# EAGLE design Controller-Modul (EAGLE 7.5.0)
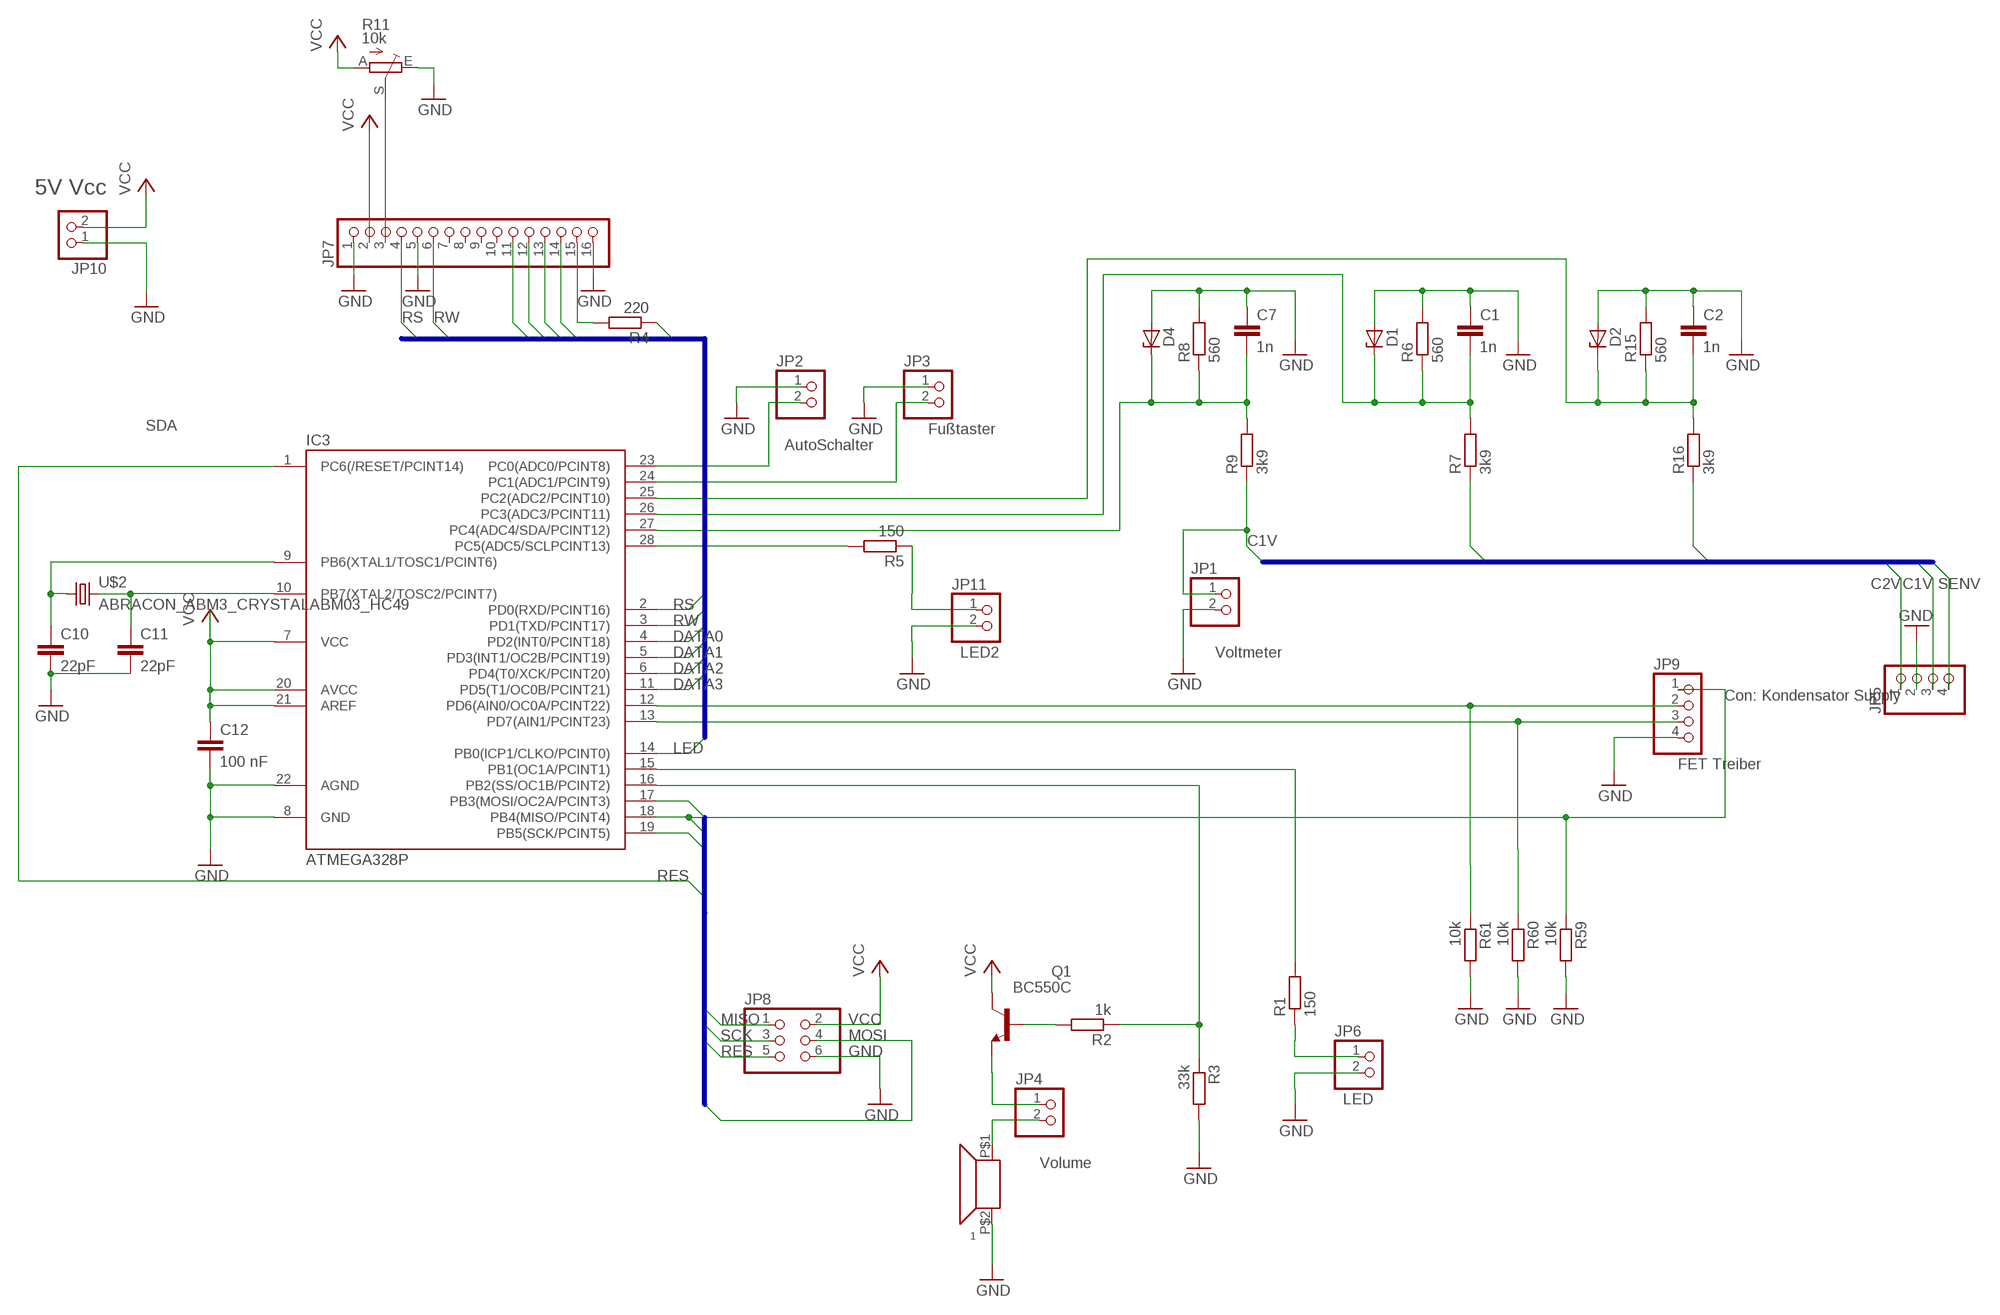
[diagram p0: schematic, sheet 1]

## Parts
1  SUMMER4  [PIEZO-INDIKATOR-KPMG]
C1  1n  C-EUC0603K  [C0603K]
C2  1n  C-EUC0603K  [C0603K]
C7  1n  C-EUC0603K  [C0603K]
C10  22pF  C-EUC0603K  [C0603K]
C11  22pF  C-EUC0603K  [C0603K]
C12  100 nF  C-EUC0603  [C0603]
D1  ZENER-DIODESOT23  [SOT23]
D2  ZENER-DIODESOT23  [SOT23]
D4  ZENER-DIODESOT23  [SOT23]
IC3  ATMEGA328P  MEGA48/88/168-PU  [DIL28-3]
JP1  PINHD-1X2  [1X02]
JP2  PINHD-1X2  [1X02]
JP3  PINHD-1X2  [1X02]
JP4  PINHD-1X2  [1X02]
JP5  PINHD-1X4  [1X04]
JP6  PINHD-1X2  [1X02]
JP7  PINHD-1X16  [1X16]
JP8  PINHD-2X3  [2X03]
JP9  PINHD-1X4  [1X04]
JP10  PINHD-1X2  [1X02]
JP11  PINHD-1X2  [1X02]
Q1  BC550C  [TO92-EBC]
R1  150  R-EU_R1206  [R1206]
R2  1k  R-EU_R1206  [R1206]
R3  33k  R-EU_R1206  [R1206]
R4  220  R-EU_R1206  [R1206]
R5  150  R-EU_R1206  [R1206]
R6  560  R-EU_R1206  [R1206]
R7  3k9  R-EU_R1206  [R1206]
R8  560  R-EU_R1206  [R1206]
R9  3k9  R-EU_R1206  [R1206]
R11  10k  TRIM_EU-PT10  [PT-10]
R15  560  R-EU_R1206  [R1206]
R16  3k9  R-EU_R1206  [R1206]
R59  10k  R-EU_R1206  [R1206]
R60  10k  R-EU_R1206  [R1206]
R61  10k  R-EU_R1206  [R1206]
U$2  ABRACON_ABM3_CRYSTALABM03_HC49  [ABM03_HC49]

## Nets
C1V: JP1.1 JP5.3 R9.1
C2V: JP5.1 R7.1
DATA0: IC3.4(PD2(INT0/PCINT18)) JP7.11
DATA1: IC3.5(PD3(INT1/OC2B/PCINT19)) JP7.12
DATA2: IC3.6(PD4(T0/XCK/PCINT20)) JP7.13
DATA3: IC3.11(PD5(T1/OC0B/PCINT21)) JP7.14
FET2: IC3.13(PD7(AIN1/PCINT23)) JP9.3 R60.1
FET3: IC3.12(PD6(AIN0/OC0A/PCINT22)) JP9.2 R61.1
GND: 1.P$2(+) C1.1 C2.1 C7.1 C10.2 C11.2 C12.2 D1.1(A) D2.1(A) D4.1(A) IC3.8(GND) IC3.22(AGND) JP1.2 JP2.1 JP3.1 JP5.2 JP6.2 JP7.1 JP7.5 JP7.16 JP8.6 JP9.4 JP10.1 JP11.2 R3.2 R6.2 R8.2 R11.E R15.2 R59.2 R60.2 R61.2
LED: IC3.14(PB0(ICP1/CLKO/PCINT0)) R4.1
MISO: IC3.18(PB4(MISO/PCINT4)) JP8.1 JP9.1 R59.1
MOSI: IC3.17(PB3(MOSI/OC2A/PCINT3)) JP8.4
N$1: JP11.1 R5.1
N$2: IC3.28(PC5(ADC5/SCLPCINT13)) R5.2
N$4: Q1.B R2.2
N$5: C7.2 D4.3(C) IC3.27(PC4(ADC4/SDA/PCINT12)) R8.1 R9.2
N$6: JP6.1 R1.1
N$7: C1.2 D1.3(C) IC3.26(PC3(ADC3/PCINT11)) R6.1 R7.2
N$9: IC3.16(PB2(SS/OC1B/PCINT2)) R2.1 R3.1
N$10: IC3.23(PC0(ADC0/PCINT8)) JP2.2
N$11: JP4.1 Q1.E
N$12: IC3.24(PC1(ADC1/PCINT9)) JP3.2
N$13: 1.P$1(-) JP4.2
N$18: C2.2 D2.3(C) IC3.25(PC2(ADC2/PCINT10)) R15.1 R16.2
N$26: IC3.15(PB1(OC1A/PCINT1)) R1.2
N$27: C11.1 IC3.10(PB7(XTAL2/TOSC2/PCINT7)) U$2.2
N$28: C10.1 IC3.9(PB6(XTAL1/TOSC1/PCINT6)) U$2.1
N$32: JP7.3 R11.S
N$47: JP7.15 R4.2
RES: IC3.1(PC6(/RESET/PCINT14)) JP8.5
RS: IC3.2(PD0(RXD/PCINT16)) JP7.4
RW: IC3.3(PD1(TXD/PCINT17)) JP7.6
SCK: IC3.19(PB5(SCK/PCINT5)) JP8.3
SENV: JP5.4 R16.1
VCC: C12.1 IC3.7(VCC) IC3.20(AVCC) IC3.21(AREF) JP7.2 JP8.2 JP10.2 Q1.C R11.A
Unconnected: JP7.7 JP7.8 JP7.9 JP7.10

## Buses
DISPLAY:DATA[0..3],RS,RW,LED
ISP:MISO,MOSI,SCK,RES
VOLTAGEMEASURES:C1V,C2V,SENV

## Notes on the sheet
- 5V Vcc
- SDA | Fußtaster
- AutoSchalter
- LED2 | Voltmeter
- Con: Kondensator Supply
- FET Treiber
- LED
- Volume

## Library data of the parts
1 = 0liver:SUMMER: SUMMER BS 27HS :: Piezosummer https://www.reichelt.de/Signalakustik/SUMMER-BS-27HS/3/index.html?&ACTION=3&LA=446&GROUPID=6560&ARTICLE=35922
C1 C2 C7 = rcl:C-EU: CAPACITOR, European symbol
C10-C12 = resistor:C-EU: CAPACITOR, European symbol
D1 D2 D4 = diode:ZENER-DIODE: Z-Diode
IC3 = avr-6:MEGA48/88/168-PU
JP1-JP4 JP6 JP10 JP11 = pinhead:PINHD-1X2: PIN HEADER
JP5 JP9 = pinhead:PINHD-1X4: PIN HEADER
JP7 = pinhead:PINHD-1X16: PIN HEADER
JP8 = pinhead:PINHD-2X3: PIN HEADER
Q1 = transistor-npn:BC550*: NPN Transistor
R1 R5 = rcl:R-EU_: RESISTOR, European symbol
R2-R4 R6-R9 R15 R16 R59-R61 = resistor:R-EU_: RESISTOR, European symbol
R11 = pot:TRIM_EU-: POTENTIOMETER
U$2 = Ava:ABRACON_ABM3_CRYSTAL

## Board
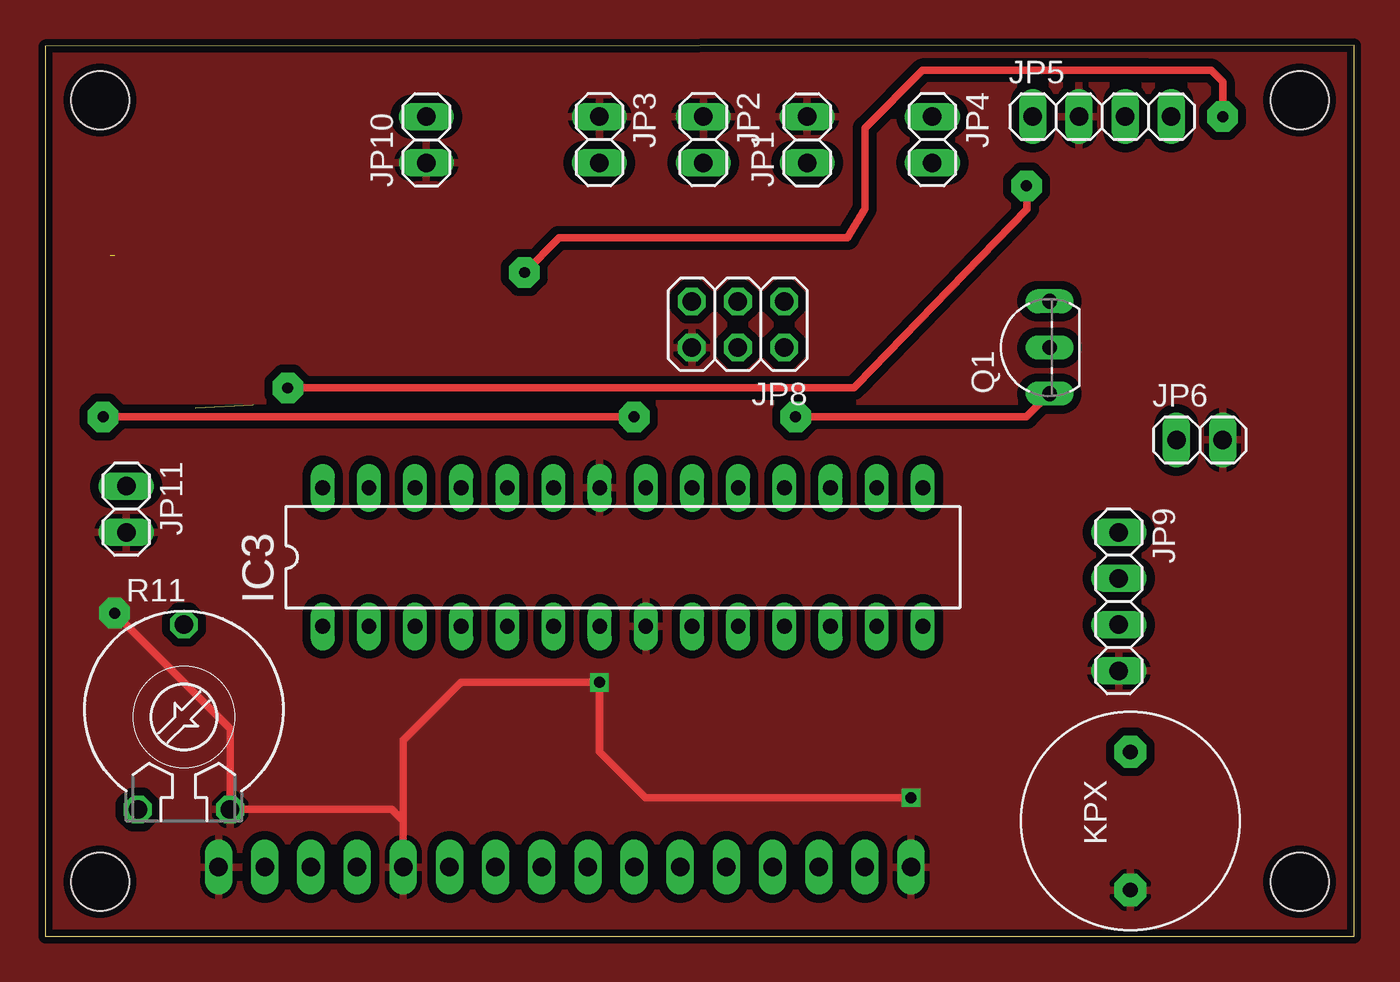
[diagram p1: board, top side]
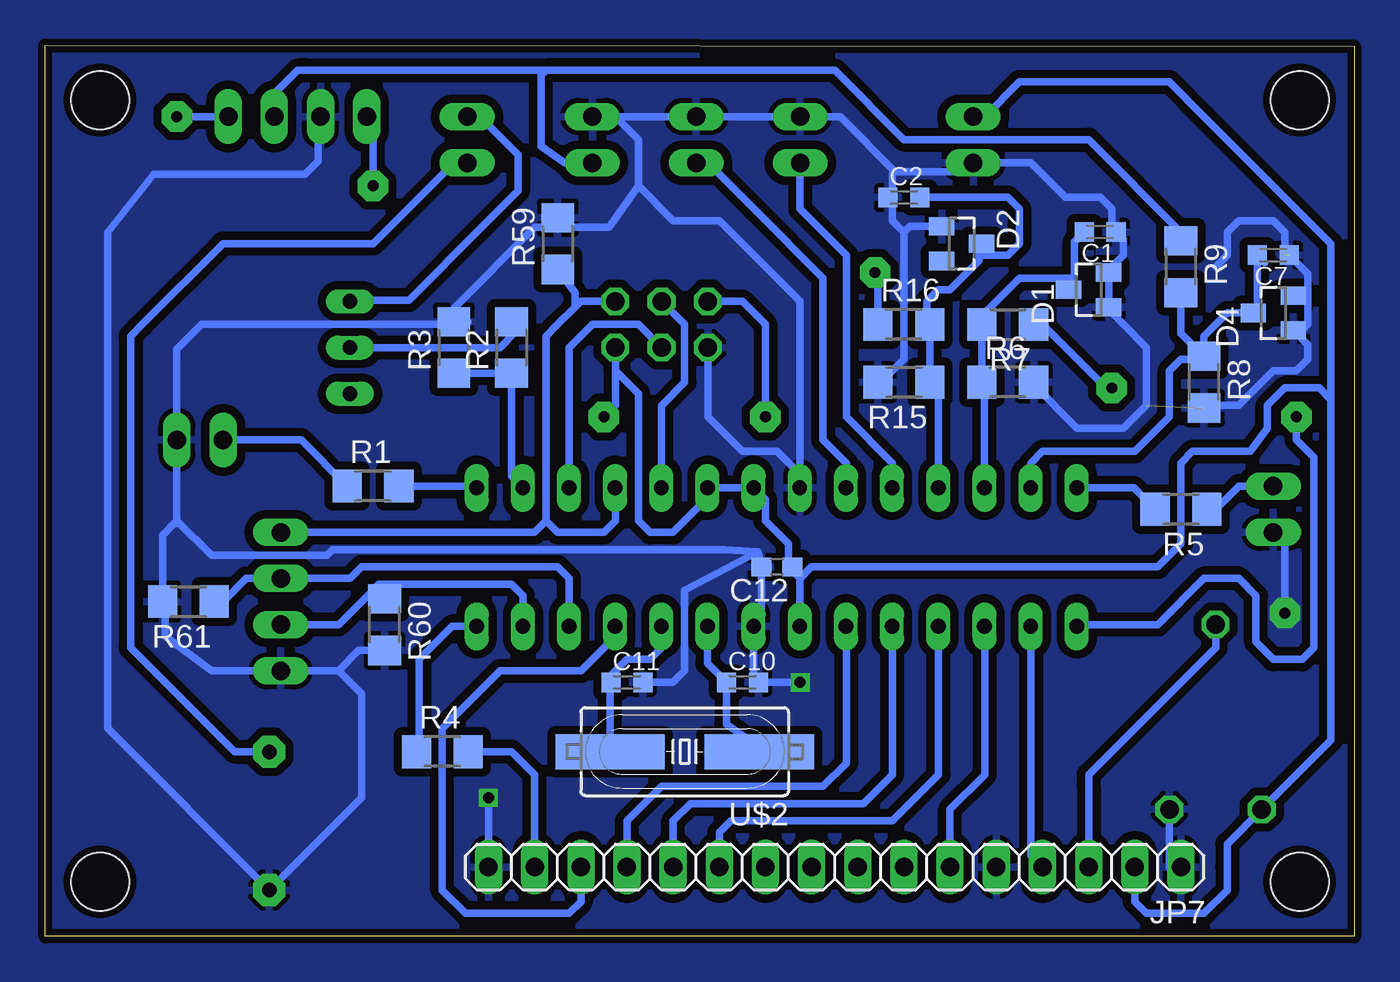
[diagram p2: board, bottom side, seen from below]

Size 72 x 49 mm. Coordinates in mm from the lower left corner, seen from the top.
Outline: 0,0 72,0 72,49 0,48.95 0,0
Copper layers (1*16): Top 0.035mm / dielectric 1.5mm / Bottom 0.035mm
Design rules "default *": minimum track width 10mil, minimum drill 24mil, track to track 18mil, track to pad 18mil, pad to pad 18mil, via to via 18mil, smd to smd 8mil, copper to edge 15mil, drill to drill 8mil, minimum pad ring 10mil, minimum via ring 8mil, stop-mask expansion 4mil, vias tented up to drill 0mil, thermal gap 10mil
Holes 3.2 mm at 3,3 69,3 3,46 69,46

### Footprints (pad centres in the part's own frame; a part is rotated, then mirrored left to right if it is on the bottom)
PIEZO-INDIKATOR-KPMG = drill 0.8 pad 1.778 octagon: P$1 3.8,0; P$2 -3.8,0
C0603K = smd 1.05 x 1.08: 1 -0.875,0; 2 0.875,0
C0603 = smd 1.1 x 1: 1 -0.85,0; 2 0.85,0
SOT23 = smd 1 x 1.4: 1 -0.95,-1.1; 2 0.95,-1.1; 3 0,1.1
DIL28-3 = drill 0.813 long: 1 -16.51,-3.81; 2 -13.97,-3.81; 3 -11.43,-3.81; 4 -8.89,-3.81; 5 -6.35,-3.81; 6 -3.81,-3.81; 7 -1.27,-3.81; 8 1.27,-3.81; 9 3.81,-3.81; 10 6.35,-3.81; 11 8.89,-3.81; 12 11.43,-3.81; 13 13.97,-3.81; 14 16.51,-3.81; 15 16.51,3.81; 16 13.97,3.81; 17 11.43,3.81; 18 8.89,3.81; 19 6.35,3.81; 20 3.81,3.81; 21 1.27,3.81; 22 -1.27,3.81; 23 -3.81,3.81; 24 -6.35,3.81; 25 -8.89,3.81; 26 -11.43,3.81; 27 -13.97,3.81; 28 -16.51,3.81
1X02 = drill 1.016 long: 1 -1.27,0; 2 1.27,0
1X04 = drill 1.016 long: 1 -3.81,0; 2 -1.27,0; 3 1.27,0; 4 3.81,0
1X16 = drill 1.016 long: 1 -19.05,0; 2 -16.51,0; 3 -13.97,0; 4 -11.43,0; 5 -8.89,0; 6 -6.35,0; 7 -3.81,0; 8 -1.27,0; 9 1.27,0; 10 3.81,0; 11 6.35,0; 12 8.89,0; 13 11.43,0; 14 13.97,0; 15 16.51,0; 16 19.05,0
2X03 = drill 1.016 octagon: 1 -2.54,-1.27; 2 -2.54,1.27; 3 0,-1.27; 4 0,1.27; 5 2.54,-1.27; 6 2.54,1.27
TO92-EBC = drill 0.813 long: B 0,-1.27; C -2.54,-1.27; E 2.54,-1.27
R1206 = smd 1.6 x 1.803: 1 -1.422,0; 2 1.422,0
PT-10 = drill 1.016 octagon: A -2.54,-5.08; E 2.54,-5.08; S 0,5.08
ABM03_HC49 = smd 6 x 1.93: 1 -4.1,0; 2 4.1,0

### Placement (x,y rotation side)
1  59.69,6.35 90 top
C1  13.97,38.73 180 bottom
C2  24.77,40.64 0 bottom
C7  4.45,37.47 180 bottom
C10  33.66,13.97 0 bottom
C11  40.01,13.97 0 bottom
C12  31.75,20.32 180 bottom
D1  14.61,35.56 90 bottom
D2  21.59,38.1 270 bottom
D4  4.45,34.29 90 bottom
IC3  31.77,20.86 0 top
JP1  41.91,43.81 90 top
JP2  36.2,43.81 270 top
JP3  30.48,43.81 270 top
JP4  48.8,43.81 270 top
JP5  58.13,45.09 0 top
JP6  63.5,27.3 0 top
JP7  28.57,3.81 180 bottom
JP8  38.1,33.66 180 top
JP9  59.05,18.41 270 top
JP10  20.95,43.81 90 top
JP11  4.45,23.5 270 top
Q1  53.98,32.38 90 top
R1  53.98,24.77 0 bottom
R2  46.35,32.38 90 bottom
R3  49.53,32.38 90 bottom
R4  50.16,10.16 0 bottom
R5  9.53,23.5 180 bottom
R6  19.05,30.48 0 bottom
R7  19.05,33.66 180 bottom
R8  8.26,30.48 270 bottom
R9  9.53,36.83 270 bottom
R11  7.62,12.06 0 top
R15  24.77,30.48 180 bottom
R16  24.77,33.66 0 bottom
R59  43.81,38.1 90 bottom
R60  53.34,17.14 270 bottom
R61  64.14,18.41 180 bottom
U$2  36.83,10.16 180 bottom

### Tracks (layer width: path | path; a pad name or v marks a point on that pad's centre or on a via)
C1V
  Bottom 0.406: JP1.1 43.45,42.55 44.72,43.45 44.72,47.35 44.45,47.62 | 44.45,47.62 28.57,47.62 24.77,43.81 14.61,43.81 9.53,38.73 R9.1 | 57.5,47.62 58.13,47.62 | 58.13,47.62 57.5,47.62 | 57.5,47.62 44.45,47.62 | 57.5,47.62 58.13,47.62 | 58.13,47.62 59.41,46.35 JP5.3
C2V  (via drill 0.6 pad 1.68)
  Top 0.406: 44.48,30.16 44.62,30.31 | 44.62,30.31 54,40 54,40.95 54,41.25 v53.98,41.27 | v13.34,30.16 44.48,30.16 44.62,30.31
  Bottom 0.406: R7.1 17.14,33.66 14.61,31.11 13.97,30.48 13.65,30.48 v13.34,30.16 | v53.98,41.27 53.98,44.73 JP5.1
DATA0
  Bottom 0.406: JP7.11 34.92,5.71 34.29,6.35 25.4,6.35 22.86,8.89 22.86,17.04 IC3.4
DATA1
  Bottom 0.406: JP7.12 37.47,6.35 36.51,7.3 26.99,7.3 25.4,8.89 25.4,17.04 IC3.5
DATA2
  Bottom 0.406: JP7.13 40.01,6.35 38.1,8.26 29.21,8.26 27.94,9.53 27.94,17.04 IC3.6
DATA3
  Bottom 0.406: JP7.14 42.55,1.91 43.18,1.27 48.9,1.27 50.16,2.54 50.16,11.43 46.99,14.61 42.55,14.61 40.64,16.51 40.64,17.04 IC3.11
FET2
  Bottom 0.406: IC3.13 45.73,18.75 46.35,19.37 53.66,19.37 53.98,19.05 | 53.98,19.05 55.88,17.14 JP9.3 | R60.1 53.98,18.57 53.98,19.05
FET3
  Bottom 0.406: IC3.12 43.2,19.7 43.5,20 | 43.5,20 43.81,20.32 | 43.81,20.32 54.61,20.32 55.24,19.68 JP9.2 60.96,19.68 62.23,18.41 R61.1 | 43.81,20.32 43.5,20
GND  (via drill 0.6, 0.6 pad 1.02, 0.6 pad 1.68)  (2 unrouted)
  Top 0.406: 19.68,6.35 19.68,10.79 22.86,13.97 v30.48,13.97 30.48,10.16 33.02,7.62 45.72,7.62 v47.62,7.62 | 19.68,6.35 JP7.5 19.68,6.35 | 19.68,6.35 19.05,6.99 R11.E 10.16,11.43 v3.81,17.78
  Bottom 0.406: R11.E 10.16,3.81 | 10.16,3.81 9.53,5.08 10.16,3.81 | 10.16,3.81 JP7.1 | 32.81,21.16 C12.2 32.6,17.48 IC3.8 33.03,14.22 C10.2 v30.48,13.97 | JP8.6 35.56,28.57 33.66,26.67 31.75,26.67 30.5,25.41 IC3.22 30.48,24.68 30.48,34.92 31.11,35.56 31.75,36.2 34.92,39.37 37.47,39.37 39.37,41.27 | C11.2 37.47,13.97 36.83,14.61 36.83,19.05 32.81,21.16 | 40.64,45.09 JP2.1 JP3.1 28.27,45.09 25.25,42.06 | 40.64,45.09 JP1.2 | 39.37,41.27 39.37,43.81 40.64,45.09 | 43.18,39.01 45.09,39.01 49.53,34.56 R3.2 48.74,33.81 48.9,33.66 63.41,33.66 64.77,32.29 | 43.18,39.01 41.01,39.01 39.37,41.27 | 64.77,32.29 JP6.2 64.77,22.86 | 64.77,22.86 64.77,22.73 64.77,22.86 | 32.81,21.16 34.61,21.27 55.24,21.27 56.2,21.27 56.52,20.95 62.87,20.95 64.77,22.86 | JP5.2 57,44.95 57,42.63 57.73,41.91 66.04,41.91 68.58,38.73 68.58,34.29 68.58,13.34 68.58,11.44 1.P$2 54.61,7.63 54.61,13.34 55.88,14.61 | JP11.2 3.81,21.59 v3.81,17.78 | 3.81,31.11 3.17,31.11 | 3.17,31.11 3.81,31.11 | 3.81,31.11 4.45,31.11 | 4.45,31.11 6.35,29.21 | 6.35,29.21 8.1,29.21 R8.2 | R15.2 26.04,30.48 24.77,31.75 24.77,36.83 24.77,38.73 | 25.25,42.06 20.95,42.06 JP10.1 17.78,42.55 15.88,40.64 13.97,40.64 13.34,40.01 13.34,38.98 C1.1 12.7,38.34 12.7,37.47 13.51,36.66 D1.1 13.34,34.44 13.34,34.29 12.7,33.66 11.43,32.38 11.43,29.21 12.7,27.94 15.24,27.94 17.63,30.33 R6.2 | 25.25,42.06 25.4,41.91 25.4,40.88 C2.1 25.4,40.4 25.4,39.37 24.77,38.73 | 6.35,29.21 4.45,31.11 | 4.45,31.11 3.81,31.11 | 3.81,37.47 3.81,38.73 4.45,39.37 6.35,39.37 6.99,38.73 6.99,37.47 7.62,36.83 | 64.77,32.29 64.77,22.86 | 55.88,14.61 JP9.4 62.87,14.61 65.41,16.51 65.41,18.26 R61.2 65.56,22.07 64.77,22.86
  Bottom 0.406: v47.62,7.62 JP7.16 | 3.81,31.11 3.17,31.11 | 3.17,31.11 2.54,31.75 2.54,32.53 D4.1 2.85,33.34 2.54,33.66 2.54,36.44 C7.1 | D2.1 24.45,39.05 24.77,38.73 | R59.2 43.81,38.89 43.18,39.01 | R60.2 54.76,15.72 55.88,14.61
  pour Bottom: -5.08,-3.17 74.3,-3.17 73.66,52.07 -4.45,51.44
  pour Top: -6.99,56.52 78.74,56.52 78.74,-6.99 -7.62,-6.99 -7.62,56.52
LED
  Bottom 0.406: IC3.14 49.62,17.05 51.44,15.24 51.44,10.31 R4.1
MISO
  Bottom 0.406: JP8.1 42.55,34.92 42.86,34.61 | 42.86,34.61 43.81,33.66 44.45,33.02 44.45,22.86 | 44.45,22.86 43.81,22.23 41.27,22.23 40.64,22.86 40.64,24.66 IC3.18 | JP9.1 57.78,22.23 57.15,22.23 45.09,22.23 44.45,22.86 | R59.1 42.86,35.41 42.86,34.61
MOSI
  Bottom 0.406: JP8.4 39.37,33.66 41.91,33.66 43.18,32.38 43.18,24.68 IC3.17
N$1
  Bottom 0.406: R5.1 7.62,23.5 6.35,24.77 JP11.1
N$2
  Bottom 0.406: IC3.28 12.12,24.67 R5.2
N$3
  pour Top: -3.81,53.34 75.56,53.34 75.56,-3.81 -3.81,-3.81
N$4
  Bottom 0.406: R2.2 46.2,33.17 46.99,32.38 52.07,32.38 Q1.B
N$5
  Bottom 0.406: IC3.27 17.8,26.02 17.14,26.67 12.06,26.67 10.79,27.94 10.16,28.57 10.16,31.11 9.53,31.75 8.41,31.75 R8.1 | R9.2 9.53,33.17 R8.1 | R8.1 8.26,33.02 6.99,34.29 D4.3 | D4.3 5.22,34.29 | 4.91,37.05 C7.2 5.32,34.29 5.22,34.29 | D4.3 5.22,34.29
N$6
  Bottom 0.406: JP6.1 57.94,27.3 R1.1
N$7
  Bottom 0.406: IC3.26 20.34,30.34 R6.1 R7.2 20.47,34.14 19.05,35.56 18.41,36.2 15.38,36.2 | 15.07,38.51 C1.2 15.38,38.2 15.38,36.2 | D1.3 15.71,35.88 15.38,36.2
N$9
  Bottom 0.406: IC3.16 46.35,25.32 R2.1 R3.1
N$10
  Bottom 0.406: JP2.2 35.56,42.55 33.02,40.01 29.21,36.2 29.21,27.3 27.94,26.04 27.94,24.68 IC3.23
N$11
  Bottom 0.406: JP4.1 48.09,45.09 46,43 46,41 48,39 52,35 55.17,35 Q1.E
N$12
  Bottom 0.406: JP3.2 30.48,40.01 27.94,37.47 27.94,28.57 25.4,26.04 25.4,24.68 IC3.24
N$13
  Bottom 0.406: JP4.2 49.53,42.55 53.98,38.1 62.23,38.1 66.67,33.66 67.31,33.02 67.31,15.88 61.59,10.16 1.P$1
N$16
  pour Bottom: -7.62,54.61 76.83,54.61 76.83,-5.08 -7.62,-5.08
N$18
  Bottom 0.406: IC3.25 22.88,30.01 R15.1 R16.2 23.5,33.81 23.5,34.92 22.86,35.56 22.23,35.56 20.64,37.15 20.64,37.47 | C2.2 19.05,40.64 18.41,40.01 18.41,38.1 19.05,37.47 20.18,37.47 20.64,37.47 | 20.64,37.47 20.64,37.95 D2.3
N$26
  Bottom 0.406: R1.2 48.37,24.77 IC3.15
N$27
  Bottom 0.406: U$2.2 40.93,13.92 C11.1 40.88,14.37 40.01,15.24 38.73,15.24 38.1,15.88 38.1,17.04 IC3.10
N$28
  Bottom 0.406: IC3.9 35.58,15.02 C10.1 34.53,11.67 32.38,10.16 32.38,9.81 U$2.1
N$32
  Bottom 0.406: JP7.3 14.61,8.26 14.61,8.89 7.62,15.88 R11.S
N$47
  Bottom 0.406: JP7.15 45.09,8.89 46.35,10.16 R4.2
RES  (via drill 0.6 pad 1.68)
  Top 0.406: v32.38,28.57 v3.17,28.57
  Bottom 0.406: JP8.5 33.66,34.92 32.38,33.66 v32.38,28.57 | v3.17,28.57 3.17,27.3 2.54,26.67 2.22,26.35 2.22,21.27 2.22,15.88 2.86,15.24 4.45,15.24 5.4,16.19 5.4,18.73 6.35,19.68 8.26,19.68 10.79,17.14 12.06,17.14 15.16,17.14 IC3.1
RS
  Bottom 0.406: IC3.2 17.8,4.46 JP7.4
RW
  Bottom 0.406: JP7.6 22.23,6.99 20.32,8.89 20.32,17.04 IC3.3
SCK
  Bottom 0.406: IC3.19 38.12,29.2 36.83,30.48 36.83,33.66 JP8.3
SENV  (via drill 0.6 pad 1.68)
  Top 0.406: JP5.4 61.95,46.35 | v26.35,36.51 28.26,38.42 44.13,38.42 45.09,40.01 45.09,44.45 48.26,47.62 60.67,47.62 64.14,47.62 64.77,46.99 v64.77,45.09
  Bottom 0.406: R16.1 26.19,36.35 v26.35,36.51 | v64.77,45.09 JP5.4
VCC  (via drill 0.6 pad 1.68)
  Top 0.406: v41.27,28.57 53.98,28.57 Q1.C
  Bottom 0.406: JP7.2 12.06,1.91 11.43,1.27 10.79,1.27 8.26,1.27 6.99,2.54 6.99,3.81 6.99,5.08 R11.A 1.27,10.79 1.27,28.57 | IC3.7 30.5,19.91 C12.1 | IC3.7 30.5,19.7 31.11,20.32 31.11,21.59 32.38,22.86 32.38,24.02 IC3.21 IC3.20 35.58,24.11 37.47,22.23 38.73,22.23 39.37,22.86 39.37,29.84 40.64,31.11 JP8.2 40.64,29.21 v41.27,28.57 | IC3.7 30.5,19.67 29.84,20.32 12.06,20.32 10.79,20.32 9.53,21.59 9.53,26.04 8.89,26.67 5.71,26.67 4.76,27.94 4.76,29.21 3.81,30.16 3.17,30.16 1.91,30.16 1.27,29.53 | 1.27,29.53 1.27,28.57 | 1.27,29.53 1.27,37.47 1.27,38.1 8.26,45.09 10.16,46.99 18.41,46.99 20.32,45.09 JP10.2 | 1.27,29.53 1.27,28.57